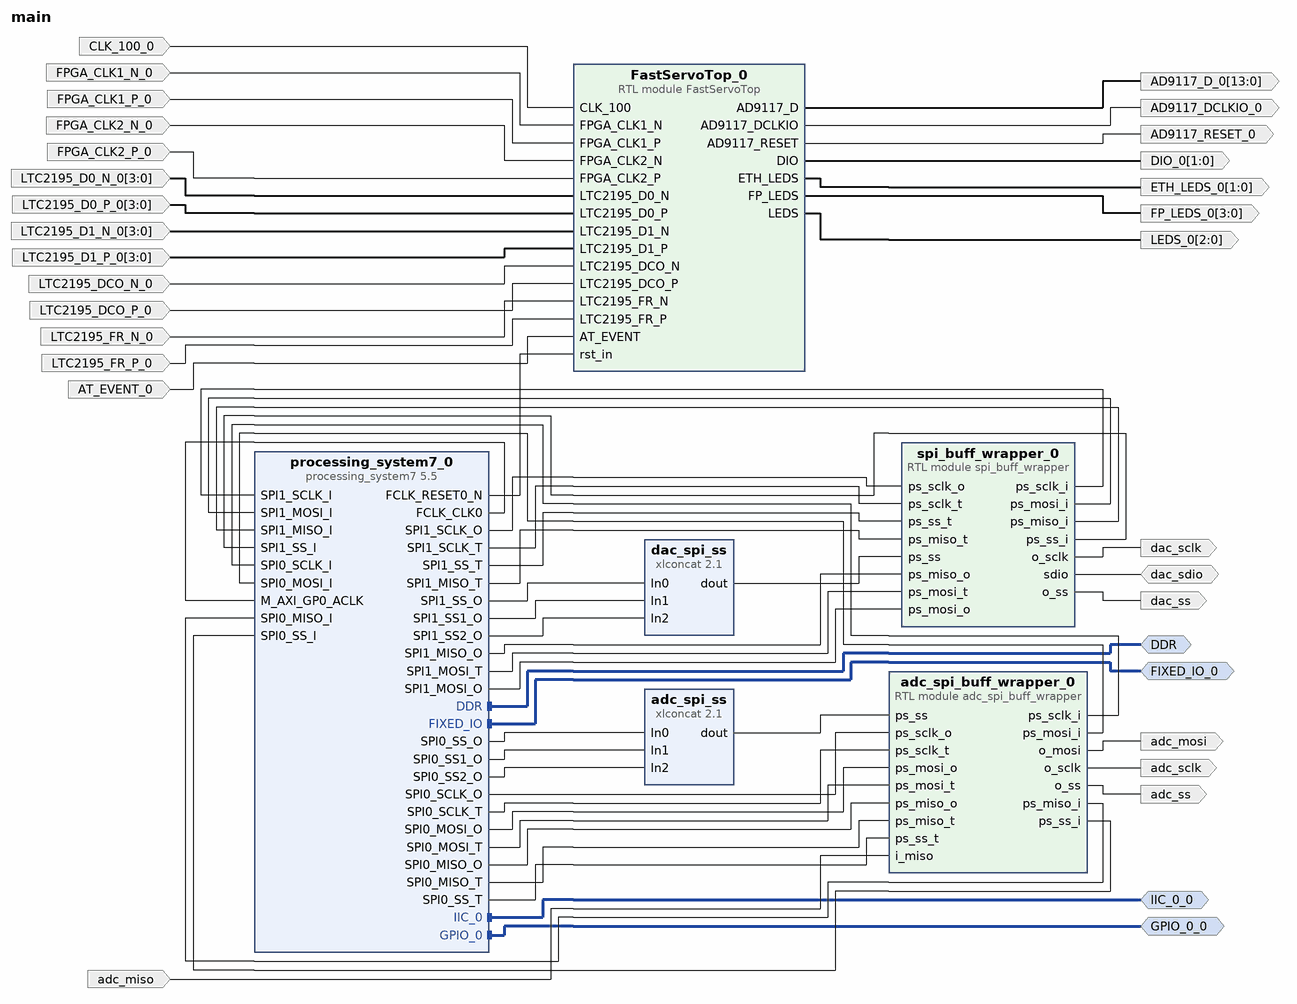
[diagram p0: block diagram of the top level]
# Vivado block design main, xc7z020clg484-2, Vivado 2020.2
create_bd_design main

create_bd_intf_port -mode Master -vlnv xilinx.com:interface:ddrx_rtl:1.0 DDR
create_bd_intf_port -mode Master -vlnv xilinx.com:interface:iic_rtl:1.0 IIC_0_0
create_bd_intf_port -mode Master -vlnv xilinx.com:display_processing_system7:fixedio_rtl:1.0 FIXED_IO_0
create_bd_intf_port -mode Master -vlnv xilinx.com:interface:gpio_rtl:1.0 GPIO_0_0
create_bd_port -dir O -from 13 -to 0 AD9117_D_0
create_bd_port -dir O AD9117_DCLKIO_0
create_bd_port -dir O -type rst AD9117_RESET_0
create_bd_port -dir I CLK_100_0
create_bd_port -dir O -from 1 -to 0 DIO_0
create_bd_port -dir O -from 3 -to 0 FP_LEDS_0
create_bd_port -dir I FPGA_CLK1_N_0
create_bd_port -dir I FPGA_CLK1_P_0
create_bd_port -dir I FPGA_CLK2_N_0
create_bd_port -dir I FPGA_CLK2_P_0
create_bd_port -dir O -from 2 -to 0 LEDS_0
create_bd_port -dir I -from 3 -to 0 LTC2195_D0_N_0
create_bd_port -dir I -from 3 -to 0 LTC2195_D0_P_0
create_bd_port -dir I -from 3 -to 0 LTC2195_D1_N_0
create_bd_port -dir I -from 3 -to 0 LTC2195_D1_P_0
create_bd_port -dir I LTC2195_DCO_N_0
create_bd_port -dir I LTC2195_DCO_P_0
create_bd_port -dir I LTC2195_FR_N_0
create_bd_port -dir I LTC2195_FR_P_0
create_bd_port -dir O -from 1 -to 0 ETH_LEDS_0
create_bd_port -dir I AT_EVENT_0
create_bd_port -dir O dac_sclk
create_bd_port -dir O dac_ss
create_bd_port -dir IO dac_sdio
create_bd_port -dir O adc_ss
create_bd_port -dir O adc_sclk
create_bd_port -dir O adc_mosi
create_bd_port -dir I adc_miso

create_bd_cell -type ip -vlnv xilinx.com:ip:processing_system7:5.5 processing_system7_0
set_property -dict [list \
  CONFIG.PCW_APU_PERIPHERAL_FREQMHZ 666.666666 \
  CONFIG.PCW_CPU_CPU_6X4X_MAX_RANGE 767 \
  CONFIG.PCW_ENET0_ENET0_IO {MIO 16 .. 27} \
  CONFIG.PCW_ENET0_GRP_MDIO_ENABLE 1 \
  CONFIG.PCW_ENET0_GRP_MDIO_IO {MIO 52 .. 53} \
  CONFIG.PCW_ENET0_PERIPHERAL_ENABLE 1 \
  CONFIG.PCW_FPGA0_PERIPHERAL_FREQMHZ 50 \
  CONFIG.PCW_FPGA1_PERIPHERAL_FREQMHZ 100 \
  CONFIG.PCW_GPIO_EMIO_GPIO_ENABLE 1 \
  CONFIG.PCW_GPIO_EMIO_GPIO_IO 44 \
  CONFIG.PCW_GPIO_EMIO_GPIO_WIDTH 44 \
  CONFIG.PCW_GPIO_MIO_GPIO_ENABLE 0 \
  CONFIG.PCW_I2C0_I2C0_IO EMIO \
  CONFIG.PCW_I2C0_PERIPHERAL_ENABLE 1 \
  CONFIG.PCW_I2C_PERIPHERAL_FREQMHZ 110 \
  CONFIG.PCW_PERIPHERAL_BOARD_PRESET part0 \
  CONFIG.PCW_PRESET_BANK1_VOLTAGE {LVCMOS 1.8V} \
  CONFIG.PCW_QSPI_GRP_SINGLE_SS_ENABLE 1 \
  CONFIG.PCW_QSPI_GRP_SINGLE_SS_IO {MIO 1 .. 6} \
  CONFIG.PCW_QSPI_PERIPHERAL_ENABLE 1 \
  CONFIG.PCW_QSPI_QSPI_IO {MIO 1 .. 6} \
  CONFIG.PCW_SD0_GRP_CD_ENABLE 0 \
  CONFIG.PCW_SD0_GRP_WP_ENABLE 0 \
  CONFIG.PCW_SD0_PERIPHERAL_ENABLE 1 \
  CONFIG.PCW_SD0_SD0_IO {MIO 40 .. 45} \
  CONFIG.PCW_SDIO_PERIPHERAL_FREQMHZ 100 \
  CONFIG.PCW_SINGLE_QSPI_DATA_MODE x4 \
  CONFIG.PCW_SPI0_PERIPHERAL_ENABLE 1 \
  CONFIG.PCW_SPI0_SPI0_IO EMIO \
  CONFIG.PCW_SPI1_PERIPHERAL_ENABLE 1 \
  CONFIG.PCW_SPI1_SPI1_IO EMIO \
  CONFIG.PCW_UART0_PERIPHERAL_ENABLE 1 \
  CONFIG.PCW_UART0_UART0_IO {MIO 10 .. 11} \
  CONFIG.PCW_UART1_PERIPHERAL_ENABLE 0 \
  CONFIG.PCW_UART_PERIPHERAL_FREQMHZ 100 \
  CONFIG.PCW_UIPARAM_DDR_FREQ_MHZ 533.333333 \
  CONFIG.PCW_UIPARAM_DDR_PARTNO {MT41J128M8 JP-125} \
  CONFIG.PCW_USB0_PERIPHERAL_ENABLE 1 \
  CONFIG.PCW_USB0_USB0_IO {MIO 28 .. 39} \
] [get_bd_cells processing_system7_0]
# 464 more settings of processing_system7_0 are not shown: defaults, MIO pin electricals, DDR timing, and values the tool derives
create_bd_cell -type ip -vlnv xilinx.com:ip:xlconcat:2.1 dac_spi_ss
set_property -dict {CONFIG.NUM_PORTS 3} [get_bd_cells dac_spi_ss]
create_bd_cell -type ip -vlnv xilinx.com:ip:xlconcat:2.1 adc_spi_ss
set_property -dict {CONFIG.NUM_PORTS 3} [get_bd_cells adc_spi_ss]
create_bd_cell -type module -reference FastServoTop FastServoTop_0
create_bd_cell -type module -reference spi_buff_wrapper spi_buff_wrapper_0
create_bd_cell -type module -reference adc_spi_buff_wrapper adc_spi_buff_wrapper_0

# ---- connections ----

connect_bd_intf_net [get_bd_intf_ports DDR] [get_bd_intf_pins processing_system7_0/DDR]
connect_bd_intf_net [get_bd_intf_ports IIC_0_0] [get_bd_intf_pins processing_system7_0/IIC_0]
connect_bd_intf_net [get_bd_intf_ports FIXED_IO_0] [get_bd_intf_pins processing_system7_0/FIXED_IO]
connect_bd_intf_net [get_bd_intf_ports GPIO_0_0] [get_bd_intf_pins processing_system7_0/GPIO_0]
connect_bd_net [get_bd_pins processing_system7_0/FCLK_CLK0] [get_bd_pins processing_system7_0/M_AXI_GP0_ACLK]
connect_bd_net [get_bd_pins processing_system7_0/FCLK_RESET0_N] [get_bd_pins FastServoTop_0/rst_in]
connect_bd_net [get_bd_pins FastServoTop_0/AD9117_D] [get_bd_ports AD9117_D_0]
connect_bd_net [get_bd_pins FastServoTop_0/AD9117_DCLKIO] [get_bd_ports AD9117_DCLKIO_0]
connect_bd_net [get_bd_pins FastServoTop_0/AD9117_RESET] [get_bd_ports AD9117_RESET_0]
connect_bd_net -net CLK_100_0_1 [get_bd_ports CLK_100_0] [get_bd_pins FastServoTop_0/CLK_100]
connect_bd_net [get_bd_pins FastServoTop_0/DIO] [get_bd_ports DIO_0]
connect_bd_net [get_bd_pins FastServoTop_0/FP_LEDS] [get_bd_ports FP_LEDS_0]
connect_bd_net -net FPGA_CLK1_N_0_1 [get_bd_ports FPGA_CLK1_N_0] [get_bd_pins FastServoTop_0/FPGA_CLK1_N]
connect_bd_net -net FPGA_CLK1_P_0_1 [get_bd_ports FPGA_CLK1_P_0] [get_bd_pins FastServoTop_0/FPGA_CLK1_P]
connect_bd_net -net FPGA_CLK2_N_0_1 [get_bd_ports FPGA_CLK2_N_0] [get_bd_pins FastServoTop_0/FPGA_CLK2_N]
connect_bd_net -net FPGA_CLK2_P_0_1 [get_bd_ports FPGA_CLK2_P_0] [get_bd_pins FastServoTop_0/FPGA_CLK2_P]
connect_bd_net [get_bd_pins FastServoTop_0/LEDS] [get_bd_ports LEDS_0]
connect_bd_net -net LTC2195_D0_N_0_1 [get_bd_ports LTC2195_D0_N_0] [get_bd_pins FastServoTop_0/LTC2195_D0_N]
connect_bd_net -net LTC2195_D0_P_0_1 [get_bd_ports LTC2195_D0_P_0] [get_bd_pins FastServoTop_0/LTC2195_D0_P]
connect_bd_net -net LTC2195_D1_N_0_1 [get_bd_ports LTC2195_D1_N_0] [get_bd_pins FastServoTop_0/LTC2195_D1_N]
connect_bd_net -net LTC2195_D1_P_0_1 [get_bd_ports LTC2195_D1_P_0] [get_bd_pins FastServoTop_0/LTC2195_D1_P]
connect_bd_net -net LTC2195_DCO_N_0_1 [get_bd_ports LTC2195_DCO_N_0] [get_bd_pins FastServoTop_0/LTC2195_DCO_N]
connect_bd_net -net LTC2195_DCO_P_0_1 [get_bd_ports LTC2195_DCO_P_0] [get_bd_pins FastServoTop_0/LTC2195_DCO_P]
connect_bd_net -net LTC2195_FR_N_0_1 [get_bd_ports LTC2195_FR_N_0] [get_bd_pins FastServoTop_0/LTC2195_FR_N]
connect_bd_net -net LTC2195_FR_P_0_1 [get_bd_ports LTC2195_FR_P_0] [get_bd_pins FastServoTop_0/LTC2195_FR_P]
connect_bd_net [get_bd_pins FastServoTop_0/ETH_LEDS] [get_bd_ports ETH_LEDS_0]
connect_bd_net -net AT_EVENT_0_1 [get_bd_ports AT_EVENT_0] [get_bd_pins FastServoTop_0/AT_EVENT]
connect_bd_net [get_bd_pins processing_system7_0/SPI1_SCLK_O] [get_bd_pins spi_buff_wrapper_0/ps_sclk_o]
connect_bd_net [get_bd_pins processing_system7_0/SPI1_SCLK_T] [get_bd_pins spi_buff_wrapper_0/ps_sclk_t]
connect_bd_net [get_bd_pins spi_buff_wrapper_0/ps_sclk_i] [get_bd_pins processing_system7_0/SPI1_SCLK_I]
connect_bd_net [get_bd_pins processing_system7_0/SPI1_SS_O] [get_bd_pins dac_spi_ss/In0]
connect_bd_net [get_bd_pins processing_system7_0/SPI1_SS1_O] [get_bd_pins dac_spi_ss/In1]
connect_bd_net [get_bd_pins processing_system7_0/SPI1_SS2_O] [get_bd_pins dac_spi_ss/In2]
connect_bd_net -net xlconcat_0_dout [get_bd_pins dac_spi_ss/dout] [get_bd_pins spi_buff_wrapper_0/ps_ss]
connect_bd_net [get_bd_pins processing_system7_0/SPI1_SS_T] [get_bd_pins spi_buff_wrapper_0/ps_ss_t]
connect_bd_net [get_bd_pins processing_system7_0/SPI1_MISO_T] [get_bd_pins spi_buff_wrapper_0/ps_miso_t]
connect_bd_net [get_bd_pins processing_system7_0/SPI1_MISO_O] [get_bd_pins spi_buff_wrapper_0/ps_miso_o]
connect_bd_net [get_bd_pins processing_system7_0/SPI1_MOSI_T] [get_bd_pins spi_buff_wrapper_0/ps_mosi_t]
connect_bd_net [get_bd_pins processing_system7_0/SPI1_MOSI_O] [get_bd_pins spi_buff_wrapper_0/ps_mosi_o]
connect_bd_net [get_bd_pins spi_buff_wrapper_0/ps_mosi_i] [get_bd_pins processing_system7_0/SPI1_MOSI_I]
connect_bd_net [get_bd_pins spi_buff_wrapper_0/ps_miso_i] [get_bd_pins processing_system7_0/SPI1_MISO_I]
connect_bd_net [get_bd_pins spi_buff_wrapper_0/ps_ss_i] [get_bd_pins processing_system7_0/SPI1_SS_I]
connect_bd_net [get_bd_pins spi_buff_wrapper_0/o_sclk] [get_bd_ports dac_sclk]
connect_bd_net [get_bd_pins spi_buff_wrapper_0/o_ss] [get_bd_ports dac_ss]
connect_bd_net [get_bd_ports dac_sdio] [get_bd_pins spi_buff_wrapper_0/sdio]
connect_bd_net [get_bd_pins processing_system7_0/SPI0_SS_O] [get_bd_pins adc_spi_ss/In0]
connect_bd_net [get_bd_pins processing_system7_0/SPI0_SS1_O] [get_bd_pins adc_spi_ss/In1]
connect_bd_net [get_bd_pins processing_system7_0/SPI0_SS2_O] [get_bd_pins adc_spi_ss/In2]
connect_bd_net [get_bd_pins adc_spi_ss/dout] [get_bd_pins adc_spi_buff_wrapper_0/ps_ss]
connect_bd_net [get_bd_pins adc_spi_buff_wrapper_0/o_ss] [get_bd_ports adc_ss]
connect_bd_net [get_bd_pins adc_spi_buff_wrapper_0/o_sclk] [get_bd_ports adc_sclk]
connect_bd_net [get_bd_pins adc_spi_buff_wrapper_0/o_mosi] [get_bd_ports adc_mosi]
connect_bd_net -net i_miso_0_1 [get_bd_ports adc_miso] [get_bd_pins adc_spi_buff_wrapper_0/i_miso]
connect_bd_net [get_bd_pins processing_system7_0/SPI0_SCLK_O] [get_bd_pins adc_spi_buff_wrapper_0/ps_sclk_o]
connect_bd_net [get_bd_pins processing_system7_0/SPI0_SCLK_T] [get_bd_pins adc_spi_buff_wrapper_0/ps_sclk_t]
connect_bd_net [get_bd_pins processing_system7_0/SPI0_MOSI_O] [get_bd_pins adc_spi_buff_wrapper_0/ps_mosi_o]
connect_bd_net [get_bd_pins processing_system7_0/SPI0_MOSI_T] [get_bd_pins adc_spi_buff_wrapper_0/ps_mosi_t]
connect_bd_net [get_bd_pins processing_system7_0/SPI0_MISO_O] [get_bd_pins adc_spi_buff_wrapper_0/ps_miso_o]
connect_bd_net [get_bd_pins processing_system7_0/SPI0_MISO_T] [get_bd_pins adc_spi_buff_wrapper_0/ps_miso_t]
connect_bd_net [get_bd_pins processing_system7_0/SPI0_SS_T] [get_bd_pins adc_spi_buff_wrapper_0/ps_ss_t]
connect_bd_net [get_bd_pins adc_spi_buff_wrapper_0/ps_sclk_i] [get_bd_pins processing_system7_0/SPI0_SCLK_I]
connect_bd_net [get_bd_pins adc_spi_buff_wrapper_0/ps_mosi_i] [get_bd_pins processing_system7_0/SPI0_MOSI_I]
connect_bd_net [get_bd_pins adc_spi_buff_wrapper_0/ps_miso_i] [get_bd_pins processing_system7_0/SPI0_MISO_I]
connect_bd_net [get_bd_pins adc_spi_buff_wrapper_0/ps_ss_i] [get_bd_pins processing_system7_0/SPI0_SS_I]

validate_bd_design
save_bd_design
